# EAGLE design TSOC_GROVEY_UART (EAGLE 6.6.0)
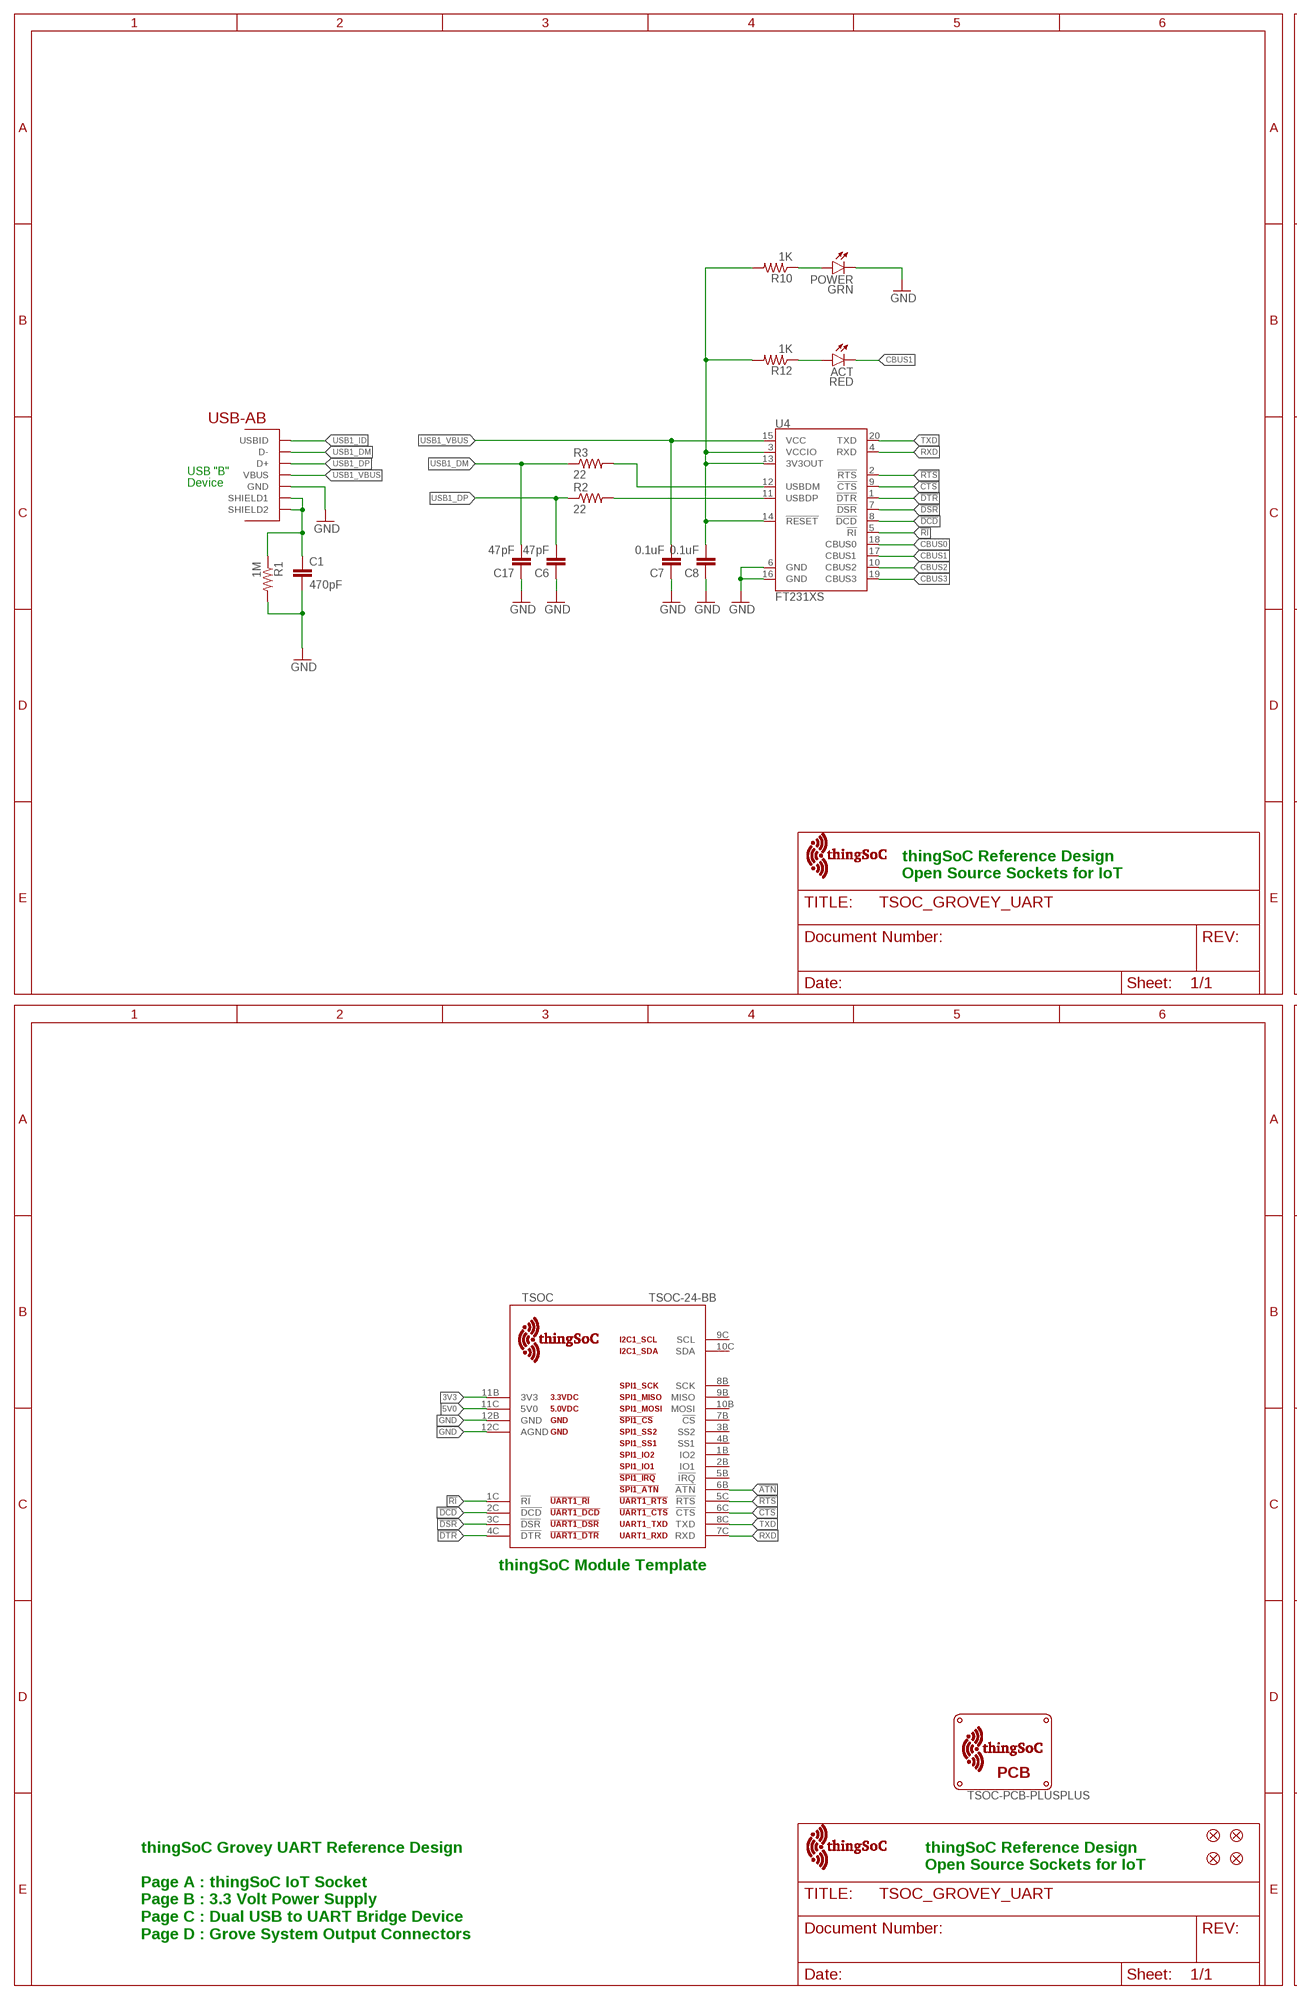
[diagram p0: schematic, sheet 1, part 1 of 2]
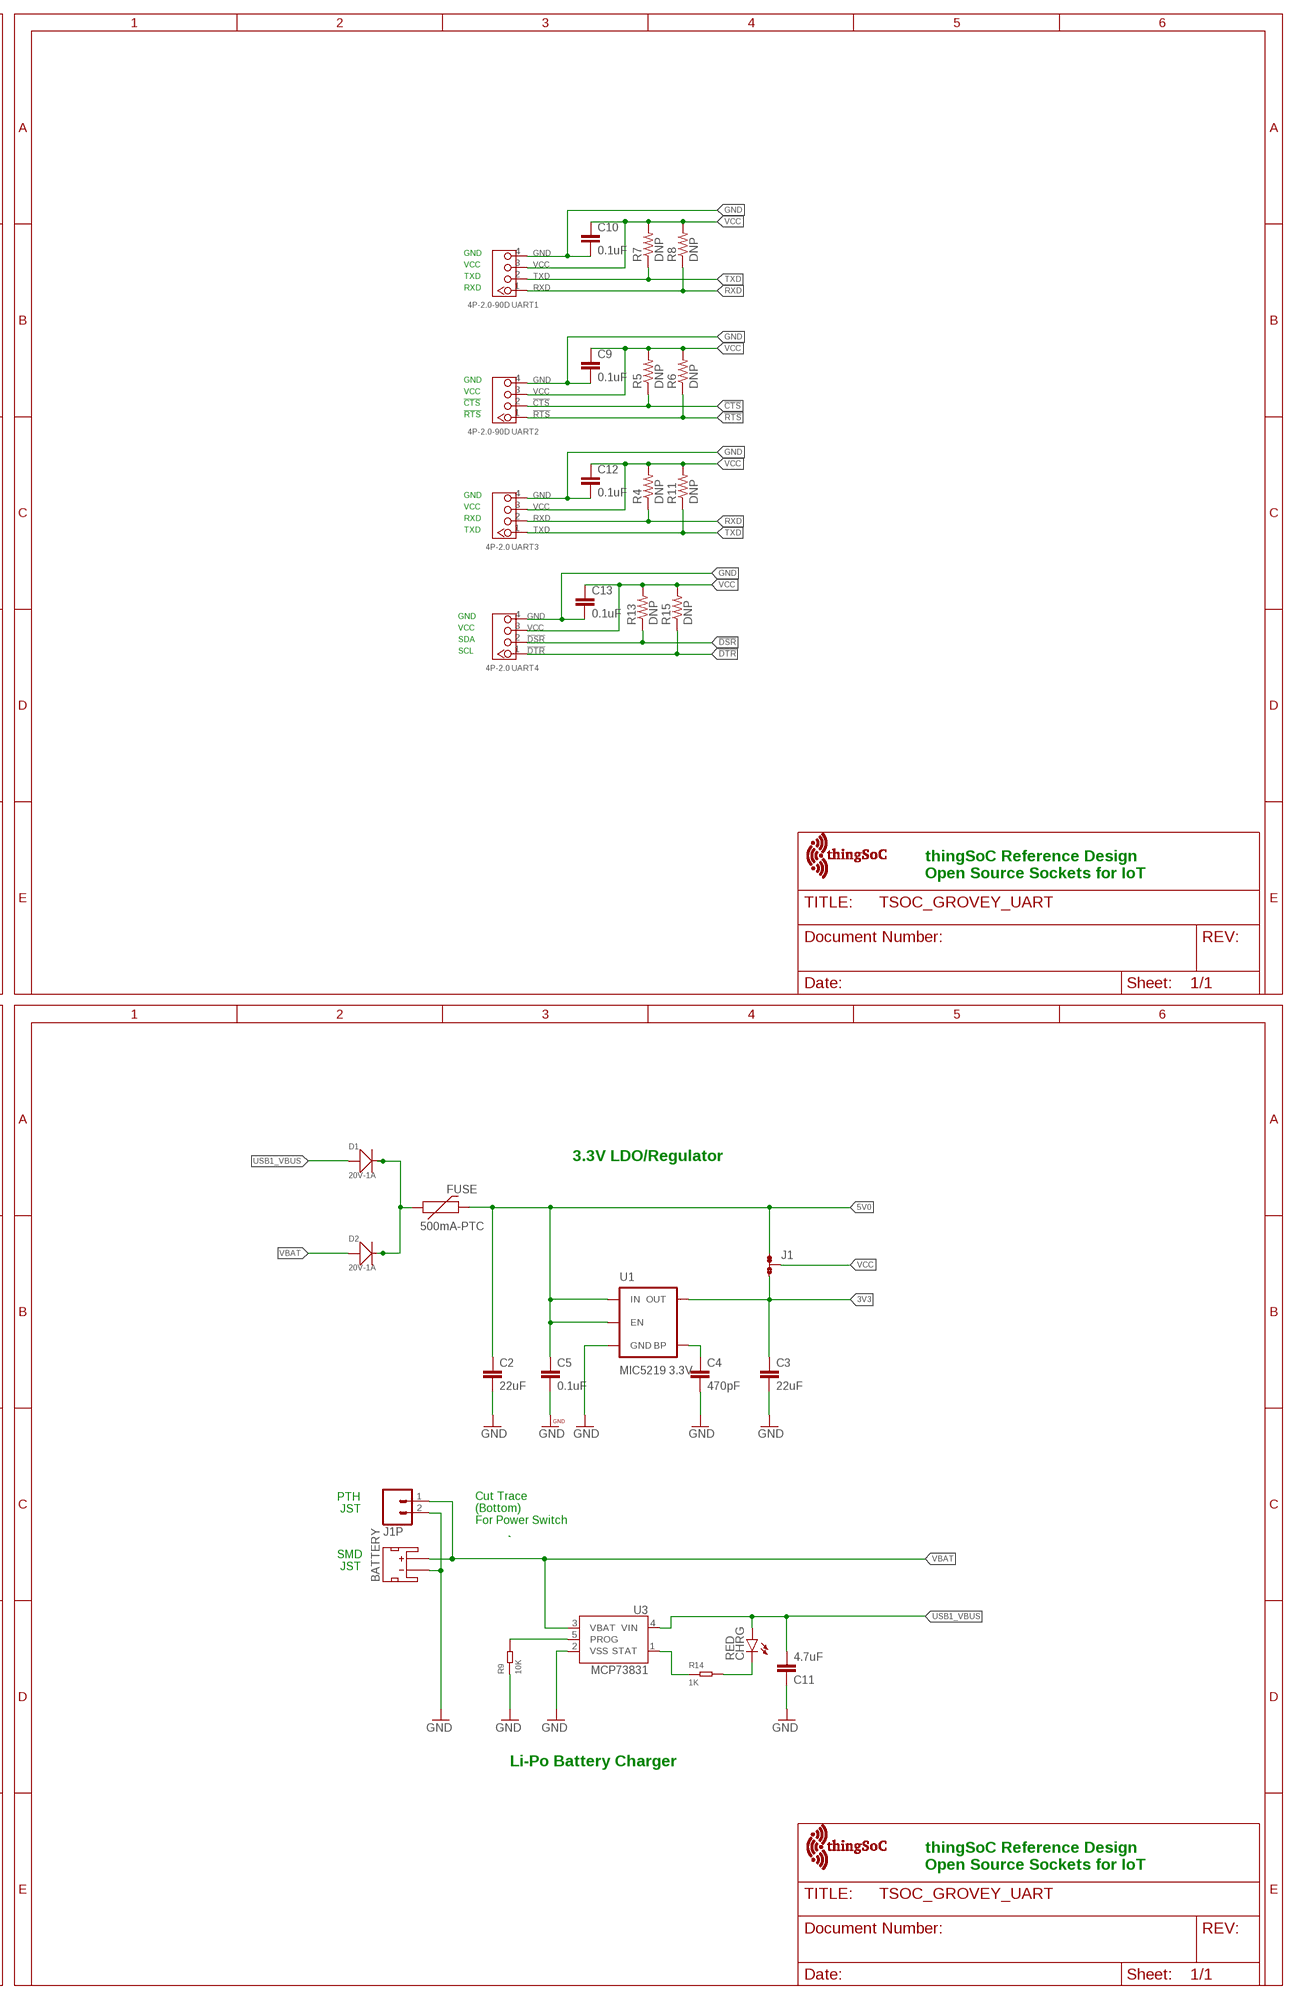
[diagram p1: schematic, sheet 1, part 2 of 2]

## Parts
ACT  RED  LED0603  [LED-0603]
BATTERY  JST_2MM_MALE  [JST-2-SMD]
C1  470pF  CAP-0603  [EIA-0603]
C2  22uF  CAP-1206  [EIA-1206]
C3  22uF  CAP-1206  [EIA-1206]
C4  470pF  CAP-0603  [EIA-0603]
C5  0.1uF  CAP-0603  [EIA-0603]
C6  47pF  CAP-0603  [EIA-0603]
C7  0.1uF  CAP-0603  [EIA-0603]
C8  0.1uF  CAP-0603  [EIA-0603]
C9  0.1uF  CAP0603-CAP  [0603-CAP]
C10  0.1uF  CAP0603-CAP  [0603-CAP]
C11  4.7uF  CAP0402-CAP  [0402-CAP]
C12  0.1uF  CAP0603-CAP  [0603-CAP]
C13  0.1uF  CAP0603-CAP  [0603-CAP]
C17  47pF  CAP-0603  [EIA-0603]
CHRG  RED  LED0603  [LED-0603]
D1  20V-1A  SMD-DIODE-SCHOTTKY-20V-1A(SOD-123)  [SOD-123]
D2  20V-1A  SMD-DIODE-SCHOTTKY-20V-1A(SOD-123)  [SOD-123]
FID1  FIDUCIALUFIDUCIAL  [MICRO-FIDUCIAL]
FID2  FIDUCIALUFIDUCIAL  [MICRO-FIDUCIAL]
FID3  FIDUCIALUFIDUCIAL  [MICRO-FIDUCIAL]
FID4  FIDUCIALUFIDUCIAL  [MICRO-FIDUCIAL]
FUSE  500mA-PTC  PTCSMD  [PTC-1206]
J1  JMP-3-1_2  [JMP-3-1_2]
J1P  M02-JST-2-PTH-NO_SILK  [JST-2-PTH-NS]
POWER  GRN  LED0603  [LED-0603]
R1  1M  RESISTOR-0603  [EIA-0603]
R2  22  RESISTOR-0603  [EIA-0603]
R3  22  RESISTOR-0603  [EIA-0603]
R4  DNP  RESISTOR0603-RES  [0603-RES]
R5  DNP  RESISTOR0603-RES  [0603-RES]
R6  DNP  RESISTOR0603-RES  [0603-RES]
R7  DNP  RESISTOR0603-RES  [0603-RES]
R8  DNP  RESISTOR0603-RES  [0603-RES]
R9  10K  SMD-RES-10K-1%-1/10W(0603)  [R0603]
R10  1K  RESISTOR-0603  [EIA-0603]
R11  DNP  RESISTOR0603-RES  [0603-RES]
R12  1K  RESISTOR-0603  [EIA-0603]
R13  DNP  RESISTOR0603-RES  [0603-RES]
R14  1K  SMD-RES-1K-1%-1/10W(0603)  [R0603]
R15  DNP  RESISTOR0603-RES  [0603-RES]
TSOC  TSOC-24-BB  [TSOC-BB-S24]
U1  MIC5219 3.3V  V_REG_MIC52193.3V  [SOT23-5]
U3  MCP73831  [SOT23-5]
U4  FT231XS  [SSOP20_L]
U$3  TSOC-LOGO-LRG  [TSOC-LOGO-LRG]
U$4  TSOC-LOGO  [TSOC-LOGO-BLANK]
U$5  TSOC-LOGO  [TSOC-LOGO-BLANK]
U$6  TSOC-LOGO  [TSOC-LOGO-BLANK]
U$8  TSOC-PCB-PLUSPLUS  [TSOC-BB-BRD-PLUS-PLUS-DIM]
UART1  4P-2.0-90D  GROVE-CONNECTOR-DIP-90D(4P-2.0)  [HW4-2.0-90D]
UART2  4P-2.0-90D  GROVE-CONNECTOR-DIP-90D(4P-2.0)  [HW4-2.0-90D]
UART3  4P-2.0  GROVE-CONNECTOR-DIP(4P-2.0)  [HW4-2.0]
UART4  4P-2.0  GROVE-CONNECTOR-DIP(4P-2.0)  [HW4-2.0]
USB  USB_AB  [USB-AB-MICRO-SMD]

## Nets
3V3: C3.1 J1.3 TSOC.11B(3V3) U1.5(OUT)
3V3U: C8.2 R10.2 R12.2 U4.3(VCCIO) U4.13(3V3OUT) U4.14(!RESET)
5V0: C2.1 C5.1 FUSE.2 J1.1 TSOC.11C(5V0) U1.1(IN) U1.3(EN)
!ATN: TSOC.6B(!ATN)
!CTS: R5.1 TSOC.6C(!CTS) U4.9(!CTS) UART2.2
!DCD: TSOC.2C(!DCD) U4.8(!DCD)
!DSR: R13.1 TSOC.3C(!DSR) U4.7(!DSR) UART4.2
!DTR: R15.1 TSOC.4C(!DTR) U4.1(!DTR) UART4.1
!RI: TSOC.1C(!RI) U4.5(!RI)
!RTS: R6.1 TSOC.5C(!RTS) U4.2(!RTS) UART2.1
BYPASS1: C4.1 U1.4(BP)
CBUS0: U4.18(CBUS0)
CBUS1: ACT.C U4.17(CBUS1)
CBUS2: U4.10(CBUS2)
CBUS3: U4.19(CBUS3)
CLED: CHRG.C R14.2
CSTAT: R14.1 U3.1(STAT)
GND [vcc]: BATTERY.1(-) C1.2 C2.2 C3.2 C4.2 C5.2 C6.1 C7.1 C8.1 C9.2 C10.2 C11.1 C12.2 C13.2 C17.1 J1P.2 POWER.C R1.2 R9.1 TSOC.12B(GND) TSOC.12C(AGND) U1.2(GND) U3.2(VSS) U4.6(GND) U4.16(GND) UART1.4 UART2.4 UART3.4 UART4.4 USB.GND
GRN: POWER.A R10.1
N$1: D1.- D2.- FUSE.1
RXD: R4.1 R8.1 TSOC.7C(RXD) U4.4(RXD) UART1.1 UART3.2
TXD: R7.1 R11.1 TSOC.8C(TXD) U4.20(TXD) UART1.2 UART3.1
USB1_DM: C17.2 R3.1 USB.D-
USB1_DP: C6.2 R2.1 USB.D+
USB1_ID: USB.ID(USBID)
USB1_M: R3.2 U4.12(USBDM)
USB1_P: R2.2 U4.11(USBDP)
USB1_SHIELD: C1.1 R1.1 USB.SHIELD1 USB.SHIELD2
USB1_VBUS: C7.2 C11.2 CHRG.A D1.+ U3.4(VIN) U4.15(VCC) USB.VBUS
VB_PROG: R9.2 U3.5(PROG)
VBAT: BATTERY.2(+) D2.+ J1P.1 U3.3(VBAT)
VCC: C9.1 C10.1 C12.1 C13.1 J1.2 R4.2 R5.2 R6.2 R7.2 R8.2 R11.2 R13.2 R15.2 UART1.3 UART2.3 UART3.3 UART4.3
YEL: ACT.A R12.1
Unconnected: BATTERY.NC1(PAD1) BATTERY.NC2(PAD2) TSOC.1B(IO2) TSOC.2B(IO1) TSOC.3B(SS2) TSOC.4B(SS1) TSOC.5B(!IRQ) TSOC.7B(!CS) TSOC.8B(SCK) TSOC.9B(MISO) TSOC.9C(SCL) TSOC.10B(MOSI) TSOC.10C(SDA)

## Notes on the sheet
- GND
- VCC
- TXD
- RXD
- GND
- VCC
- !CTS
- !RTS
- USB "B"
- Device
- GND
- VCC
- RXD
- TXD
- GND
- VCC
- SDA
- SCL
- thingSoC Reference Design
  Open Source Sockets for IoT
- thingSoC Reference Design
  Open Source Sockets for IoT
- 3.3V LDO/Regulator
- PTH
   JST
- Cut Trace
  (Bottom)
  For Power Switch
- thingSoC Module Template
- SMD
   JST
- Li-Po Battery Charger
- thingSoC Reference Design
  Open Source Sockets for IoT
- thingSoC Reference Design
  Open Source Sockets for IoT
- thingSoC Grovey UART Reference Design
  
  Page A : thingSoC IoT Socket
  Page B : 3.3 Volt Power Supply
  Page C : Dual USB to UART Bridge Device
  Page D : Grove System Output Connectors

## Library data of the parts
ACT CHRG POWER = TSOC-ESP8266-BASE:LED: LEDs Standard schematic elements and footprints for 5mm, 3mm, 1206, and 0603 sized LEDs. 5mm - Spark Fun Electronics SKU : COM-00529 (and others)
BATTERY = TSOC-ESP8266-BASE:JST_2MM_MALE: Mates to single-cell LiPo batteries. CONN-11443 Now with smashable polarity marks!; BTM_NEG: -; BTM_POS: +; PROD_ID: CONN-11443; TOP_NEG: -; TOP_POS: +
C1-C8 C17 = TSOC_USBUART2:CAP: Ceramic Capacitor SMD
C9 C10 C12 C13 = SparkFun-Passives:CAP: Capacitor Standard 0603 ceramic capacitor, and 0.1" leaded capacitor.
C11 = TSOC-ESP8266-BASE:CAP: Capacitor Standard 0603 ceramic capacitor, and 0.1" leaded capacitor.
D1 D2 = Seeed-Diode-2016:SMD-DIODE-SCHOTTKY-20V-1A(SOD-123): 304020034; MPN: B5819W
FID1-FID4 = TSOC-ESP8266-BASE:FIDUCIAL: Fiducial Alignment Points Various fiducial points for machine vision alignment.
FUSE = SparkFun:PTC: Resettable Fuse PTC Resettable Fuse. Spark Fun Electronics SKU : COM-08357
J1 = PatternAgents-ProtoPads:JMP-3-1_2: Three Terminal Jumper - 1 & 2 Connected Positions 1and 2 are normally connected. PatternAgents ProtoPads Library Schematic and PCB layout libraries for design patterns by PatternAgents. For the CADSoft Eagle CAD program : http://www.cadsoftusa.com/download-eagle/ Source LBR : http://www.patternagents.com Github : https://github.com/PatternAgents License : http://creativecommons.org/licenses/by-sa/4.0/ (Creative Commons 4.0) THIS SOFTWARE IS PROVIDED BY THE CONTRIBUTORS "AS IS" AND WITHOUT ANY EXPRESS OR IMPLIED WARRANTIES, INCLUDING, BUT NOT LIMITED TO, THE IMPLIED WARRANTIES OF MERCHANTABILITY AND FITNESS FOR A PARTICULAR PURPOSE ARE DISCLAIMED. IN NO EVENT SHALL THE COPYRIGHT OWNER OR CONTRIBUTORS BE LIABLE FOR ANY DIRECT, INDIRECT, INCIDENTAL, SPECIAL, EXEMPLARY, OR CONSEQUENTIAL DAMAGES (INCLUDING, BUT NOT LIMITED TO, PROCUREMENT OF SUBSTITUTE GOODS OR SERVICES; LOSS OF USE, DATA, OR PROFITS; OR BUSINESS INTERRUPTION) HOWEVER CAUSED AND ON ANY THEORY OF LIABILITY, WHETHER IN CONTRACT, STRICT LIABILITY, OR TORT (INCLUDING NEGLIGENCE OR OTHERWISE) ARISING IN ANY WAY OUT OF THE USE OF THIS SOFTWARE, EVEN IF ADVISED OF THE POSSIBILITY OF SUCH DAMAGE.; BOM: EXCLUDE
J1P = TSOC-ESP8266-BASE:M02: Standard 2-pin 0.1" header. Use with - straight break away headers ( PRT-00116) - right angle break away headers (PRT-00553) - swiss pins (PRT-00743) - machine pins (PRT-00117) - female headers (PRT-00115) Molex polarized connector foot print use with: PRT-08233 with associated crimp pins and housings. 2.54_SCREWTERM for use with PRT-10571. 3.5mm Screw Terminal footprints for PRT-08084 5mm Screw Terminal footprints for use with PRT-08432
R1-R3 R10 R12 = TSOC_USBUART2:RESISTOR
R4-R8 R11 R13 R15 = SparkFun-Passives:RESISTOR: Resistor Basic schematic elements and footprints for 0603, 1206, and PTH resistors.
R9 = Seeed-Resistor-2016:SMD-RES-10K-1%-1/10W(0603): 301010299; MPN: RC0603FR-0710KL
R14 = Seeed-Resistor-2016:SMD-RES-1K-1%-1/10W(0603): 301010298; MPN: RC0603FR-071KL
TSOC = thingSoC:TSOC-24: thingSoC Twenty-Four(24) Pin Socket Source LBR : http://www.thingsoc.com Github : https://github.com/thingsoc License : http://creativecommons.org/licenses/by-sa/4.0/ (Creative Commons 4.0) THIS SOFTWARE IS PROVIDED BY THE CONTRIBUTORS "AS IS" AND WITHOUT ANY EXPRESS OR IMPLIED WARRANTIES, INCLUDING, BUT NOT LIMITED TO, THE IMPLIED WARRANTIES OF MERCHANTABILITY AND FITNESS FOR A PARTICULAR PURPOSE ARE DISCLAIMED. IN NO EVENT SHALL THE COPYRIGHT OWNER OR CONTRIBUTORS BE LIABLE FOR ANY DIRECT, INDIRECT, INCIDENTAL, SPECIAL, EXEMPLARY, OR CONSEQUENTIAL DAMAGES (INCLUDING, BUT NOT LIMITED TO, PROCUREMENT OF SUBSTITUTE GOODS OR SERVICES; LOSS OF USE, DATA, OR PROFITS; OR BUSINESS INTERRUPTION) HOWEVER CAUSED AND ON ANY THEORY OF LIABILITY, WHETHER IN CONTRACT, STRICT LIABILITY, OR TORT (INCLUDING NEGLIGENCE OR OTHERWISE) ARISING IN ANY WAY OUT OF THE USE OF THIS SOFTWARE, EVEN IF ADVISED OF THE POSSIBILITY OF SUCH DAMAGE.
U1 = TSOC-ESP8266-BASE:V_REG_MIC5219: V_REG MIC5219 Standard 3.3V and 5V 500mA LDO voltage regulator in SOT-23 layout. Micrel part MIC5219. BP (by-pass) pin is used to lower output noise with 470pF cap, may be left open.; PROD_ID: VREG-09872
U3 = TSOC-ESP8266-BASE:MCP73831: Miniature single cell, fully integrated Li-Ion, Li-polymer charge management controller http://ww1.microchip.com/downloads/en/DeviceDoc/20001984g.pdf IC-09995; PROD_ID: IC-09995
U4 = SparkFun-DigitalIC:FT231X: FTDI FT231X Full Speed USB to Full-handshake UART This USB2.0 Full Speed IC offers a compact bridge to full handshake UART interfaces. The device is a UART, capable of operating up to 3MBaud, with low power consumption (8mA). The FT231X includes the complete FT-X series feature set and enables USB to be added into a system design quickly and easily over a UART interface.
U$3-U$6 = thingSoC:TSOC-LOGO: thingSoC Logo Source LBR : http://www.thingsoc.com Github : https://github.com/thingsoc License : http://creativecommons.org/licenses/by-sa/4.0/ (Creative Commons 4.0) THIS SOFTWARE IS PROVIDED BY THE CONTRIBUTORS "AS IS" AND WITHOUT ANY EXPRESS OR IMPLIED WARRANTIES, INCLUDING, BUT NOT LIMITED TO, THE IMPLIED WARRANTIES OF MERCHANTABILITY AND FITNESS FOR A PARTICULAR PURPOSE ARE DISCLAIMED. IN NO EVENT SHALL THE COPYRIGHT OWNER OR CONTRIBUTORS BE LIABLE FOR ANY DIRECT, INDIRECT, INCIDENTAL, SPECIAL, EXEMPLARY, OR CONSEQUENTIAL DAMAGES (INCLUDING, BUT NOT LIMITED TO, PROCUREMENT OF SUBSTITUTE GOODS OR SERVICES; LOSS OF USE, DATA, OR PROFITS; OR BUSINESS INTERRUPTION) HOWEVER CAUSED AND ON ANY THEORY OF LIABILITY, WHETHER IN CONTRACT, STRICT LIABILITY, OR TORT (INCLUDING NEGLIGENCE OR OTHERWISE) ARISING IN ANY WAY OUT OF THE USE OF THIS SOFTWARE, EVEN IF ADVISED OF THE POSSIBILITY OF SUCH DAMAGE.
U$8 = thingSoC:TSOC-PCB: thingSoC PCB Outlines Boards Outlines for Standard Sizes (in the DImension Layer) (Registration marks in the tDocu layer - make sure to turn on tDocu/bDocu) Source LBR : http://www.thingsoc.com Github : https://github.com/thingsoc License : http://creativecommons.org/licenses/by-sa/4.0/ (Creative Commons 4.0) THIS SOFTWARE IS PROVIDED BY THE CONTRIBUTORS "AS IS" AND WITHOUT ANY EXPRESS OR IMPLIED WARRANTIES, INCLUDING, BUT NOT LIMITED TO, THE IMPLIED WARRANTIES OF MERCHANTABILITY AND FITNESS FOR A PARTICULAR PURPOSE ARE DISCLAIMED. IN NO EVENT SHALL THE COPYRIGHT OWNER OR CONTRIBUTORS BE LIABLE FOR ANY DIRECT, INDIRECT, INCIDENTAL, SPECIAL, EXEMPLARY, OR CONSEQUENTIAL DAMAGES (INCLUDING, BUT NOT LIMITED TO, PROCUREMENT OF SUBSTITUTE GOODS OR SERVICES; LOSS OF USE, DATA, OR PROFITS; OR BUSINESS INTERRUPTION) HOWEVER CAUSED AND ON ANY THEORY OF LIABILITY, WHETHER IN CONTRACT, STRICT LIABILITY, OR TORT (INCLUDING NEGLIGENCE OR OTHERWISE) ARISING IN ANY WAY OUT OF THE USE OF THIS SOFTWARE, EVEN IF ADVISED OF THE POSSIBILITY OF SUCH DAMAGE.
UART1 UART2 = Seeed-Connector -2016:GROVE-CONNECTOR-DIP-90D(4P-2.0): 320110034
UART3 UART4 = Seeed-Connector -2016:GROVE-CONNECTOR-DIP(4P-2.0): 320110033
USB = BeeSafe:USB_AB: This is a USB AB connector that is compatible with USB OTG. i.e. this connector can serve as a host or device

## Net classes
1 vcc: width 0.254 mm

## Board
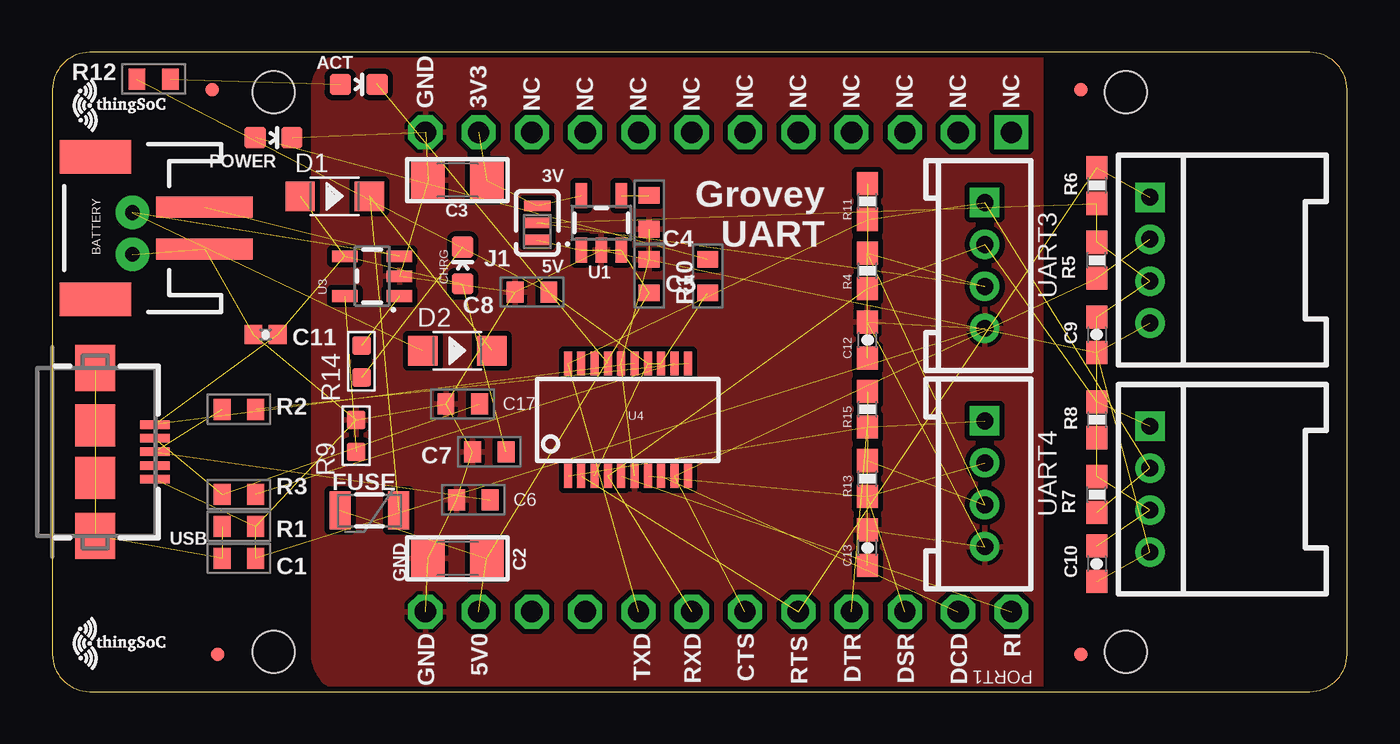
[diagram p2: board, top side]
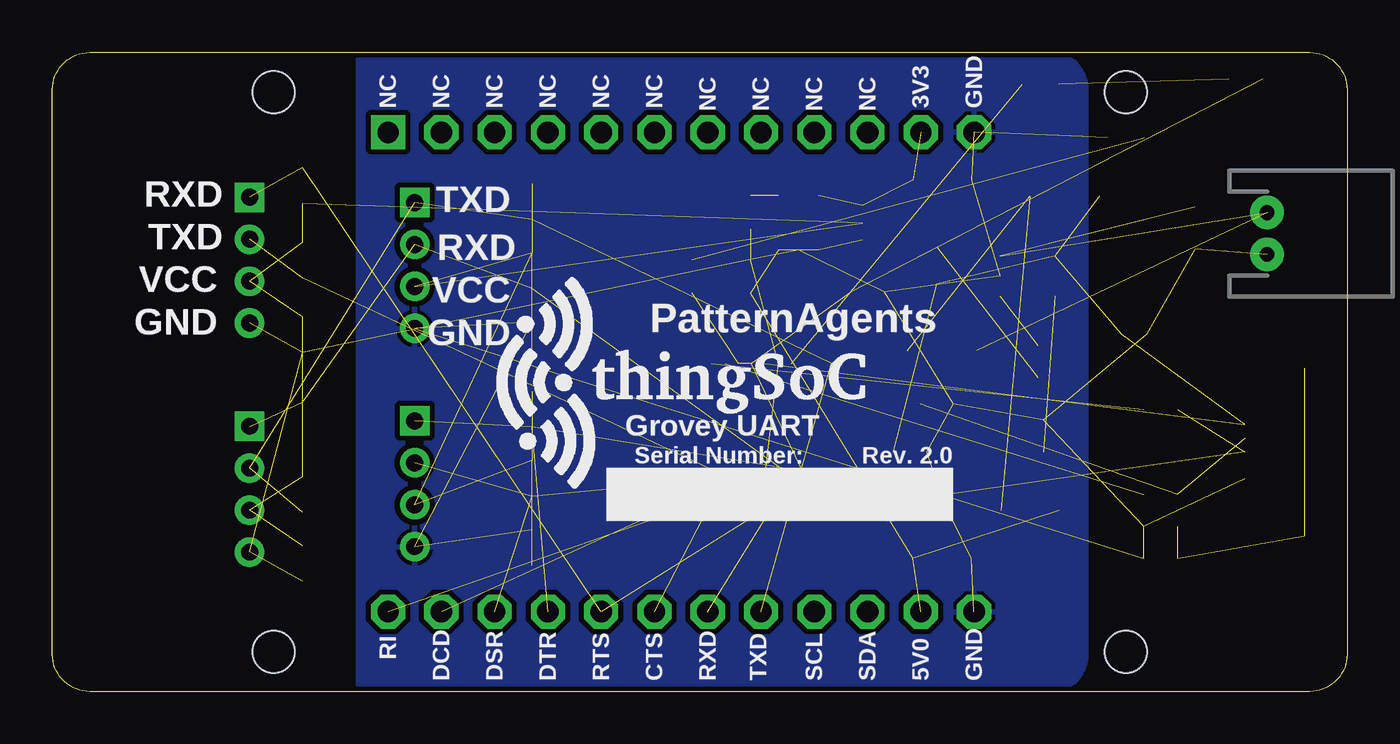
[diagram p3: board, bottom side, seen from below]

Size 61.72 x 30.48 mm. Coordinates in mm from the lower left corner, seen from the top.
Copper layers (1*16): Top 0.035mm / dielectric 1.5mm / Bottom 0.035mm
Design rules "PatternAgents_7mil": minimum track width 7mil, minimum drill 14mil, track to track 7mil, track to pad 7mil, pad to pad 7mil, via to via 7mil, smd to smd 7mil, copper to edge 7mil, drill to drill 7mil, minimum pad ring 12mil, minimum via ring 10mil, stop-mask expansion 4mil, vias tented up to drill 25mil, thermal gap 7mil

### Footprints (pad centres in the part's own frame; a part is rotated, then mirrored left to right if it is on the bottom)
LED-0603 = smd 1 x 1: A 0,-0.877; C 0,0.877
JST-2-SMD = smd 1 x 4.6: 1 -1,-3.7; 2 1,-3.7 | smd 1.6 x 3.4: NC1 -3.4,1.5; NC2 3.4,1.5
EIA-0603 = smd 0.8 x 1: 1 -0.8,0; 2 0.8,0
EIA-1206 = smd 1.6 x 1.8: 1 -1.4,0; 2 1.4,0
0603-CAP = smd 1.1 x 1: 1 -0.85,0; 2 0.85,0
0402-CAP = smd 0.85 x 0.9: 1 -0.58,0; 2 0.58,0
SOD-123 = smd 1.397 x 1.397: + -1.651,0; - 1.651,0
MICRO-FIDUCIAL = smd 0.635 x 0.635: 1 0,0
PTC-1206 = smd 1 x 1.8: 1 -1.4,0; 2 1.4,0
JMP-3-1_2 = smd 0.508 x 1.27: 1 -0.813,0; 2 0,0; 3 0.813,0
JST-2-PTH-NS = drill 0.7 pad 1.6: 1 -1,0; 2 1,0
0603-RES = smd 1.1 x 1: 1 -0.85,0; 2 0.85,0
R0603 = smd 0.889 x 0.889: 1 0,0.762; 2 0,-0.762
TSOC-BB-S24 = drill 1.016 square: 1B -11.43,11.43 | drill 1.016 octagon: 1C 11.43,11.43; 2B -11.43,8.89; 2C 11.43,8.89; 3B -11.43,6.35; 3C 11.43,6.35; 4B -11.43,3.81; 4C 11.43,3.81; 5B -11.43,1.27; 5C 11.43,1.27; 6B -11.43,-1.27; 6C 11.43,-1.27; 7B -11.43,-3.81; 7C 11.43,-3.81; 8B -11.43,-6.35; 8C 11.43,-6.35; 9B -11.43,-8.89; 9C 11.43,-8.89; 10B -11.43,-11.43; 10C 11.43,-11.43; 11B -11.43,-13.97; 11C 11.43,-13.97; 12B -11.43,-16.51; 12C 11.43,-16.51
SOT23-5 = smd 0.55 x 1.2: 1 -0.95,-1.3; 2 0,-1.3; 3 0.95,-1.3; 4 0.95,1.3; 5 -0.95,1.3
SSOP20_L = smd 0.381 x 1.143: 1 -2.857,-2.68; 2 -2.223,-2.68; 3 -1.587,-2.68; 4 -0.953,-2.68; 5 -0.318,-2.68; 6 0.318,-2.68; 7 0.953,-2.68; 8 1.587,-2.68; 9 2.223,-2.68; 10 2.857,-2.68; 11 2.857,2.68; 12 2.223,2.68; 13 1.587,2.68; 14 0.953,2.68; 15 0.318,2.68; 16 -0.318,2.68; 17 -0.953,2.68; 18 -1.587,2.68; 19 -2.223,2.68; 20 -2.857,2.68
TSOC-BB-BRD-PLUS-PLUS-DIM = hole 2: -13.335,-23.749; 13.335,-23.749; -13.335,16.891; 13.335,16.891
HW4-2.0-90D = drill 0.8 pad 1.27 square: 1 -3,0 | drill 0.8 pad 1.27: 2 -1,0; 3 1,0; 4 3,0
HW4-2.0 = drill 0.8 pad 1.27 square: 1 -3,0 | drill 0.8 pad 1.27: 2 -1,0; 3 1,0; 4 3,0
USB-AB-MICRO-SMD = smd 1.4 x 0.4: D+ 2.85,0; D- 2.85,0.65; GND 2.85,-1.3; ID 2.85,-0.65; VBUS 2.85,1.3 | smd 1.9 x 2: P$6 0,1.25; P$7 0,-1.25 | smd 1.9 x 2.2: SHIELD1 0,4; SHIELD2 0,-4

### Placement (x,y rotation side)
ACT  14.61,28.96 270 top
BATTERY  3.56,22.1 90 top
C1  8.89,6.35 0 top
C2  19.3,6.35 180 top
C3  19.3,24.38 180 top
C4  28.45,22.86 270 top
C5  28.45,19.81 90 top
C6  20.07,9.14 0 top
C7  20.83,11.43 0 top
C8  22.86,19.05 0 top
C9  49.78,17.02 270 top
C10  49.78,6.1 270 top
C11  10.16,17.02 0 top
C12  38.86,16.76 90 top
C13  38.86,6.86 90 top
C17  19.56,13.72 0 top
CHRG  19.56,20.32 0 top
D1  13.46,23.62 0 top
D2  19.3,16.26 0 top
FID1  49.02,1.78 180 top
FID2  49.02,28.7 180 top
FID3  7.62,28.7 180 top
FID4  7.87,1.78 180 top
FUSE  15.11,8.64 180 top
J1  23.11,22.35 90 top
J1P  3.81,21.84 270 bottom
POWER  10.54,26.42 270 top
R1  8.89,7.87 0 top
R2  8.89,13.46 0 top
R3  8.89,9.4 0 top
R4  38.86,20.07 90 top
R5  49.78,20.57 90 top
R6  49.78,24.13 270 top
R7  49.78,9.4 90 top
R8  49.78,12.95 270 top
R9  14.48,12.19 0 top
R10  31.24,19.81 270 top
R11  38.86,23.37 90 top
R12  4.83,29.21 180 top
R13  38.86,10.16 90 top
R14  14.73,15.75 0 top
R15  38.86,13.46 90 top
TSOC  34.29,15.24 270 top
U1  26.16,22.35 0 top
U3  15.24,19.81 90 top
U4  27.43,12.95 0 top
U$1  TSOC-LOGO-SMALL  [TSOC-LOGO-SML]  1.78,27.94 0 top
U$3  37.34,14.73 0 bottom
U$4  49.53,28.7 180 top
U$5  49.53,28.7 180 top
U$6  49.53,28.7 180 top
U$7  TSOC-LOGO-SMALL  [TSOC-LOGO-SML]  1.78,2.29 0 top
U$8  34.29,15.24 270 top
UART1  52.32,9.65 270 top
UART2  52.32,20.57 270 top
UART3  44.45,20.32 270 top
UART4  44.45,9.91 270 top
USB  2.03,11.43 0 top

### Tracks (layer width: path | path; a pad name or v marks a point on that pad's centre or on a via)
3V3  (3 unrouted)
3V3U  (5 unrouted)
5V0  (6 unrouted)
!CTS  (3 unrouted)
!DCD  (1 unrouted)
!DSR  (3 unrouted)
!DTR  (3 unrouted)
!RI  (1 unrouted)
!RTS  (3 unrouted)
BYPASS1  (1 unrouted)
CBUS1  (1 unrouted)
CLED  (1 unrouted)
CSTAT  (1 unrouted)
GND  (29 unrouted)
  pour Top (isolate 0.254, hatched): 47.12,0 14.25,0 arc-90 12.45,1.81 12.45,28.67 arc-90 14.25,30.48 47.12,30.48
  pour Bottom (isolate 0.254, hatched): 47.12,0 14.24,0 arc-90 12.45,1.8 12.45,28.67 arc-90 14.25,30.48 47.12,30.48
GRN  (1 unrouted)
N$1  (2 unrouted)
RXD  (5 unrouted)
TXD  (5 unrouted)
USB1_DM  (2 unrouted)
USB1_DP  (2 unrouted)
USB1_M  (1 unrouted)
USB1_P  (1 unrouted)
USB1_SHIELD  (3 unrouted)
USB1_VBUS  (6 unrouted)
VB_PROG  (1 unrouted)
VBAT  (3 unrouted)
VCC  (16 unrouted)
YEL  (1 unrouted)

### Text on the board
tPlace: GND | 3V3 | NC | NC | NC | NC | NC | NC | NC | NC | NC | NC | 3V | Grovey / UART | 5V | GND | GND | 5V0 | TXD | RXD | CTS | RTS | DTR | DSR | DCD | RI | PORT1
bPlace: GND | 3V3 | NC | NC | NC | NC | NC | NC | NC | NC | NC | NC | TXD | RXD | RXD | TXD | VCC | VCC | PatternAgents | GND | GND | Grovey UART | Rev. 2.0 | Serial Number: | RI | GND | 5V0 | SDA | SCL | TXD | RXD | CTS | RTS | DTR | DSR | DCD